# Altium project leddriver.PrjPCB
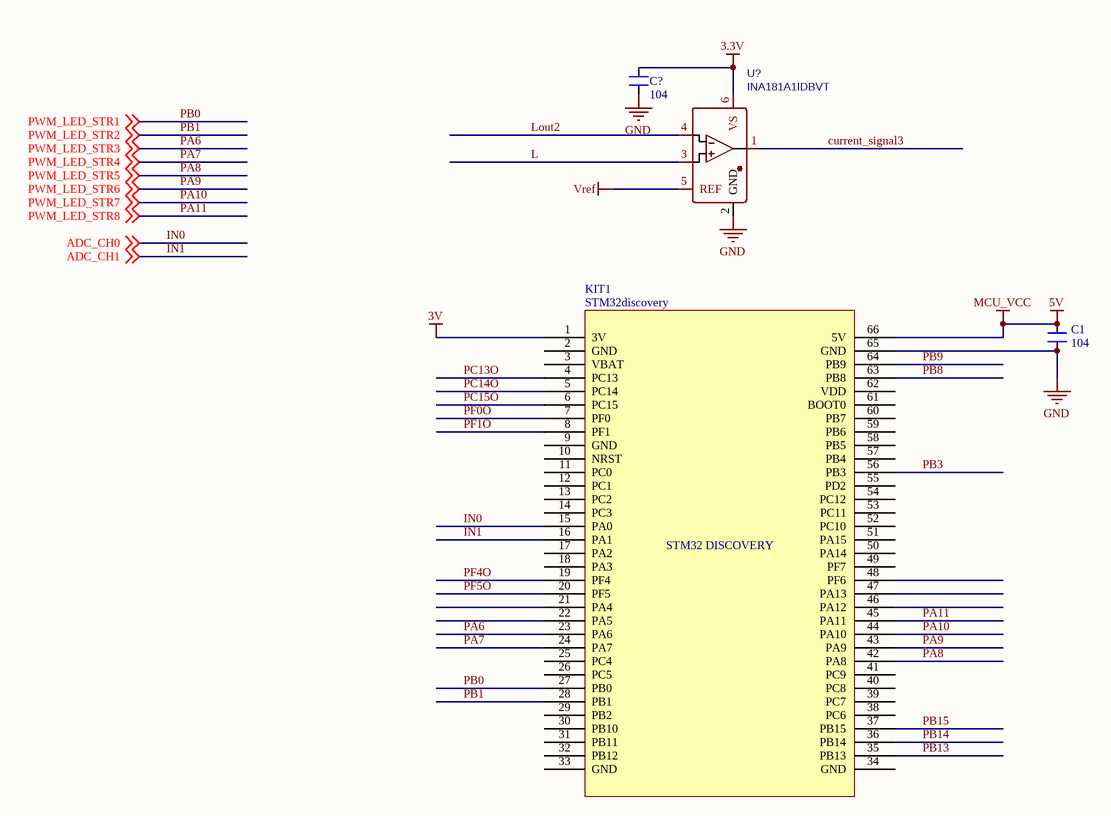
[diagram p0: leddriver.SchDoc]
3 sheets, 77 parts. Net scope: global (net labels, ports and power ports of the same name join across sheets).
Board file: leddriver.PcbDoc
Sheets:
  leddriver.SchDoc
  powerswitch.SchDoc
  PWRsupply.SchDoc

## Sheet leddriver.SchDoc: APTOMAT - Power Supply
size A4; Revision: 1.1.1; SheetNumber: 5; SheetTotal: 5; DrawnBy: KJP; ProjectNumber: 4397; PCBRevision: 0071KJP; DocumentSize: A4; PCAName: PCA10040; PCBNumber: 400150; ProjectName: Quark

### Parts
C1  104  [0805_HV]
C?  104  [0805_HV]
KIT1  STM32discovery  [STM32discovery_kit]
U?  INA181A1IDBVT  [SOT95P280X145-6N]

### Nets
3.3V: C?.2 U?.6(VS)
3V: KIT1.1(3V)
5V: C1.2 KIT1.66(5V)  [also labelled MCU_VCC]
GND: C1.1 C?.1 KIT1.65(GND) U?.2(GND)
Vref: U?.5(REF)
current_signal3: U?.1(OUT)
IN0: KIT1.15(PA0) ; off-sheet ADC_CH0  [also labelled ADC_CH0]
IN1: KIT1.16(PA1) ; off-sheet ADC_CH1  [also labelled ADC_CH1]
L: U?.3(IN+)
Lout2: U?.4(IN-)
PA6: KIT1.23(PA6) ; off-sheet PWM_LED_STR3  [also labelled PWM_LED_STR3]
PA7: KIT1.24(PA7) ; off-sheet PWM_LED_STR4  [also labelled PWM_LED_STR4]
PA8: KIT1.42(PA8) ; off-sheet PWM_LED_STR5  [also labelled PWM_LED_STR5]
PA9: KIT1.43(PA9) ; off-sheet PWM_LED_STR6  [also labelled PWM_LED_STR6]
PA10: KIT1.44(PA10) ; off-sheet PWM_LED_STR7  [also labelled PWM_LED_STR7]
PA11: KIT1.45(PA11) ; off-sheet PWM_LED_STR8  [also labelled PWM_LED_STR8]
PB0: KIT1.27(PB0) ; off-sheet PWM_LED_STR1  [also labelled PWM_LED_STR1]
PB1: KIT1.28(PB1) ; off-sheet PWM_LED_STR2  [also labelled PWM_LED_STR2]
PB3: KIT1.56(PB3)
PB8: KIT1.63(PB8)
PB9: KIT1.64(PB9)
PB13: KIT1.35(PB13)
PB14: KIT1.36(PB14)
PB15: KIT1.37(PB15)
PC13O: KIT1.4(PC13)
PC14O: KIT1.5(PC14)
PC15O: KIT1.6(PC15)
PF0O: KIT1.7(PF0)
PF1O: KIT1.8(PF1)
PF4O: KIT1.19(PF4)
PF5O: KIT1.20(PF5)

Not connected (* = marked no-connect by the designer): KIT1 2(GND) 3(VBAT) 9(GND) 10(NRST) 11(PC0) 12(PC1) 13(PC2) 14(PC3) 17(PA2) 18(PA3) 21(PA4) 22(PA5) 25(PC4) 26(PC5) 29(PB2) 30(PB10) 31(PB11) 32(PB12) 33(GND) 34(GND) 38(PC6) 39(PC7) 40(PC8) 41(PC9) 46(PA12) 47(PA13) 48(PF6) 49(PF7) 50(PA14) 51(PA15) 52(PC10) 53(PC11) 54(PC12) 55(PD2) 57(PB4) 58(PB5) 59(PB6) 60(PB7) 61(BOOT0) 62(VDD)

### Notes on the sheet
- (in symbol STM32Discovery_kit) STM32 DISCOVERY

### Library data of the parts
C1 C? = CM: Cap SMD; Value: 103
KIT1 = STM32Discovery_kit
U? = INA181: BOM_Manufacturer: Texas Instruments; BOM_Manufacturer Part: INA181A2IDBVT; Contributor: LCSC; BOM_Supplier: LCSC; BOM_Supplier Part: C116200; spicePre: U

## Sheet powerswitch.SchDoc
size B
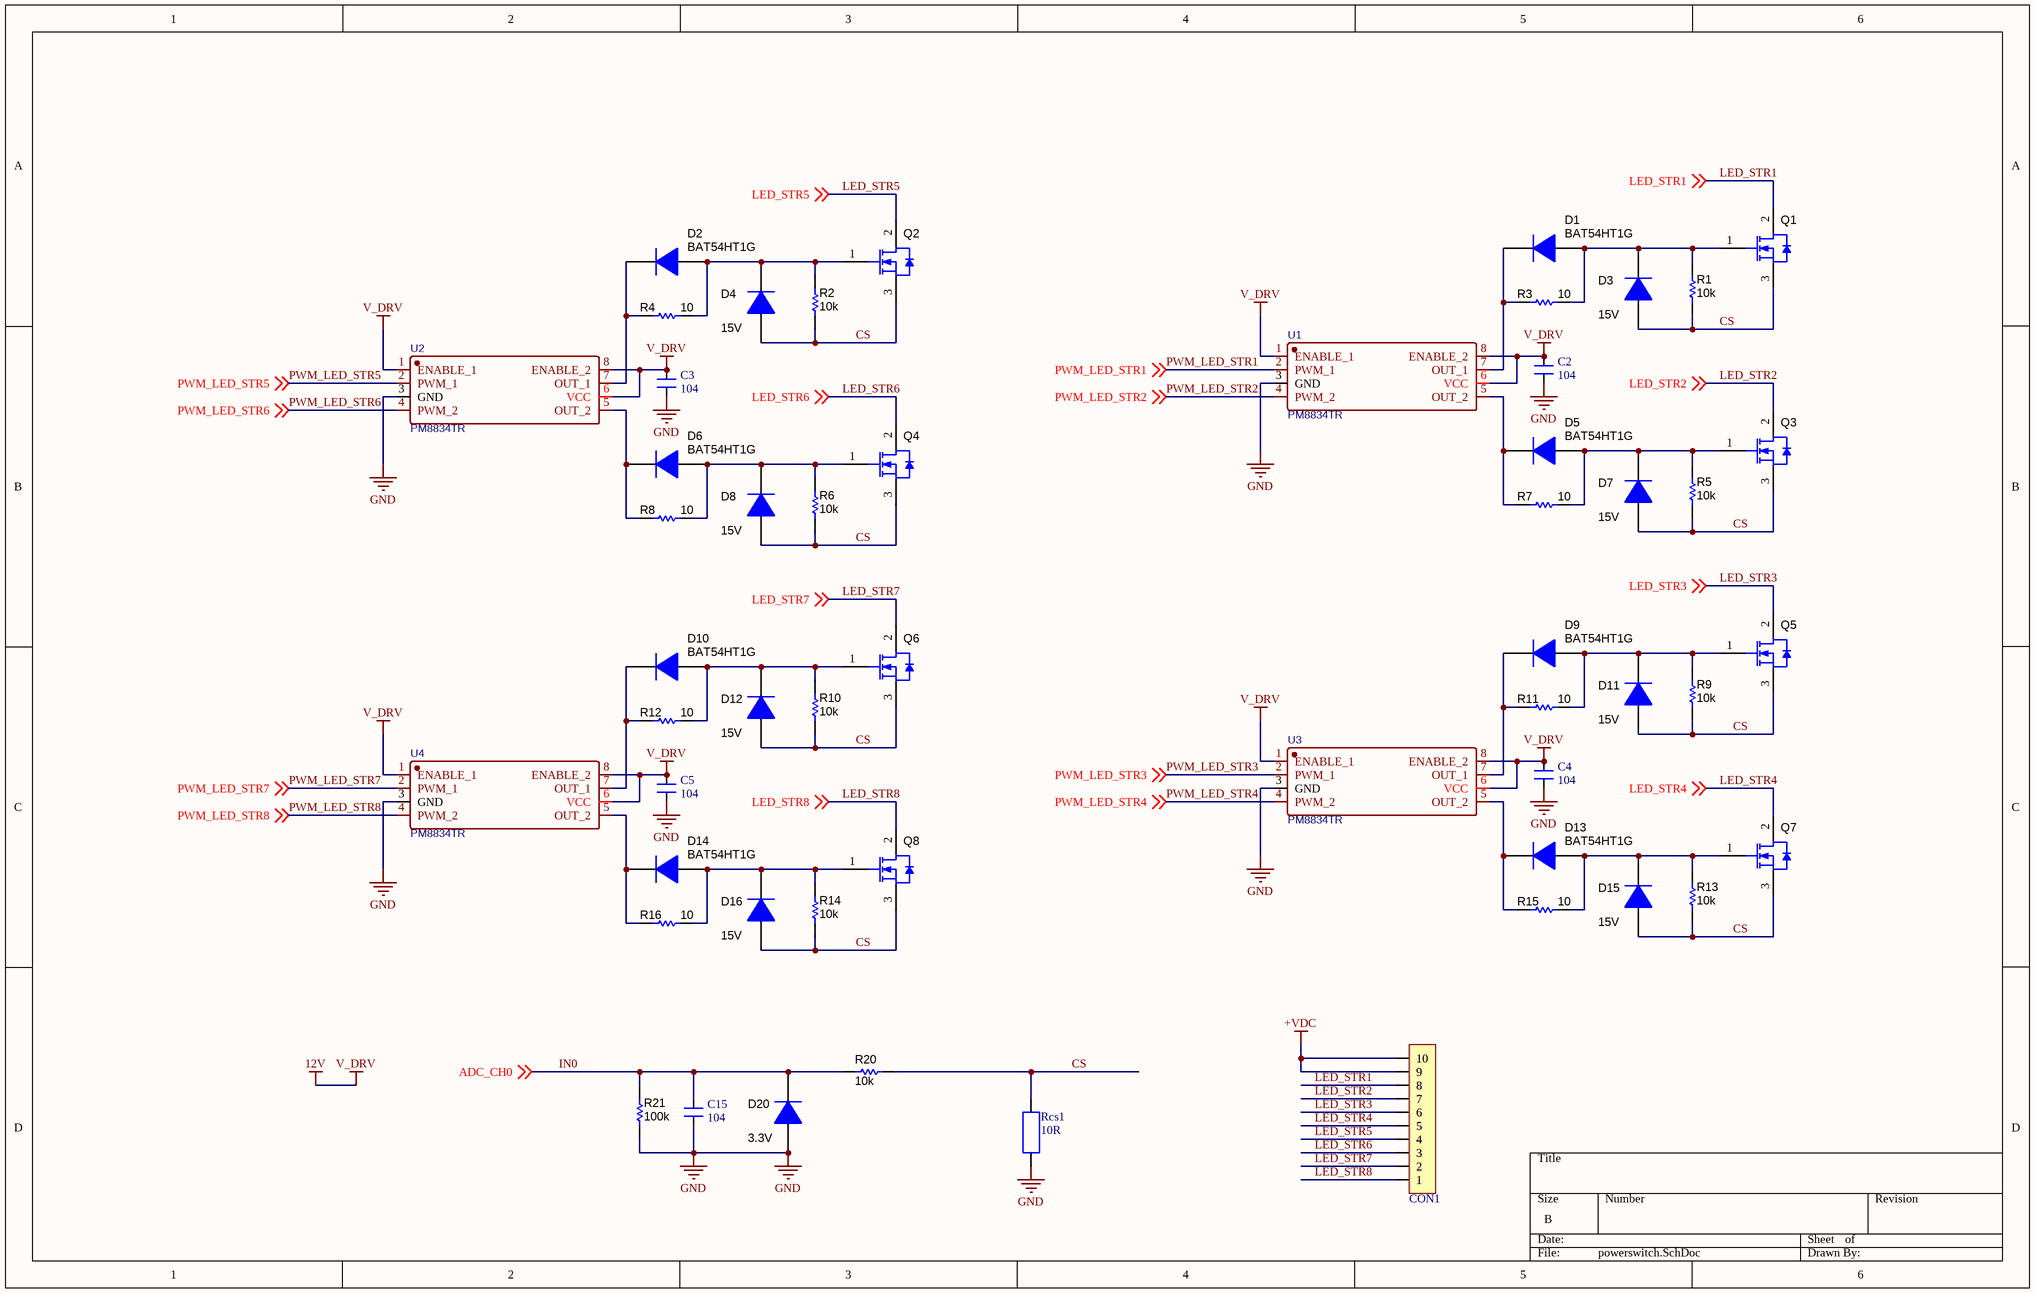
[diagram p1: powerswitch.SchDoc]

### Parts
C2  104  [0805_HV]
C3  104  [0805_HV]
C4  104  [0805_HV]
C5  104  [0805_HV]
C15  104  [0805_HV]
CON1  CON 10 EDG 5.08_MH  [Con 10 EDG 5.08]  (value not drawn)
D1  BAT54HT1G  [SOD-323]
D2  BAT54HT1G  [SOD-323]
D3  15V  [SOD-323]
D4  15V  [SOD-323]
D5  BAT54HT1G  [SOD-323]
D6  BAT54HT1G  [SOD-323]
D7  15V  [SOD-323]
D8  15V  [SOD-323]
D9  BAT54HT1G  [SOD-323]
D10  BAT54HT1G  [SOD-323]
D11  15V  [SOD-323]
D12  15V  [SOD-323]
D13  BAT54HT1G  [SOD-323]
D14  BAT54HT1G  [SOD-323]
D15  15V  [SOD-323]
D16  15V  [SOD-323]
D20  3.3V  [SOD-323]
Q1  IPA60R330P  [TO-220AB_NH]  (value not drawn)
Q2  IPA60R330P  [TO-220AB_NH]  (value not drawn)
Q3  IPA60R330P  [TO-220AB_NH]  (value not drawn)
Q4  IPA60R330P  [TO-220AB_NH]  (value not drawn)
Q5  IPA60R330P  [TO-220AB_NH]  (value not drawn)
Q6  IPA60R330P  [TO-220AB_NH]  (value not drawn)
Q7  IPA60R330P  [TO-220AB_NH]  (value not drawn)
Q8  IPA60R330P  [TO-220AB_NH]  (value not drawn)
R1  10k  [Tro SMD 0805]
R2  10k  [Tro SMD 0805]
R3  10  [Tro SMD 0805]
R4  10  [Tro SMD 0805]
R5  10k  [Tro SMD 0805]
R6  10k  [Tro SMD 0805]
R7  10  [Tro SMD 0805]
R8  10  [Tro SMD 0805]
R9  10k  [Tro SMD 0805]
R10  10k  [Tro SMD 0805]
R11  10  [Tro SMD 0805]
R12  10  [Tro SMD 0805]
R13  10k  [Tro SMD 0805]
R14  10k  [Tro SMD 0805]
R15  10  [Tro SMD 0805]
R16  10  [Tro SMD 0805]
R20  10k  [Tro SMD 0805]
R21  100k  [Tro SMD 0805]
Rcs1  10R  [TRO_VACH_2W]
U1  PM8834TR  [SOP 8]
U2  PM8834TR  [SOP 8]
U3  PM8834TR  [SOP 8]
U4  PM8834TR  [SOP 8]

### Nets
12V: C2.2 C3.2 C4.2 C5.2 U1.1(ENABLE_1) U1.6(VCC) U1.8(ENABLE_2) U2.1(ENABLE_1) U2.6(VCC) U2.8(ENABLE_2) U3.1(ENABLE_1) U3.6(VCC) U3.8(ENABLE_2) U4.1(ENABLE_1) U4.6(VCC) U4.8(ENABLE_2)  [also labelled V_DRV]
+VDC: CON1.9 CON1.10
GND: C2.1 C3.1 C4.1 C5.1 C15.1 D20.2(A) R21.2 Rcs1.1 U1.3(GND) U2.3(GND) U3.3(GND) U4.3(GND)
CS: D3.2(A) D4.2(A) D7.2(A) D8.2(A) D11.2(A) D12.2(A) D15.2(A) D16.2(A) Q1.3(S) Q2.3(S) Q3.3(S) Q4.3(S) Q5.3(S) Q6.3(S) Q7.3(S) Q8.3(S) R1.2 R2.2 R5.2 R6.2 R9.2 R10.2 R13.2 R14.2 R20.2 Rcs1.2
IN0: C15.2 D20.1(K) R20.1 R21.1 ; off-sheet ADC_CH0  [also labelled ADC_CH0]
LED_STR1: CON1.8 Q1.2(D) ; off-sheet LED_STR1
LED_STR2: CON1.7 Q3.2(D) ; off-sheet LED_STR2
LED_STR3: CON1.6 Q5.2(D) ; off-sheet LED_STR3
LED_STR4: CON1.5 Q7.2(D) ; off-sheet LED_STR4
LED_STR5: CON1.4 Q2.2(D) ; off-sheet LED_STR5
LED_STR6: CON1.3 Q4.2(D) ; off-sheet LED_STR6
LED_STR7: CON1.2 Q6.2(D) ; off-sheet LED_STR7
LED_STR8: CON1.1 Q8.2(D) ; off-sheet LED_STR8
PWM_LED_STR1: U1.2(PWM_1) ; off-sheet PWM_LED_STR1  [project net PB0]
PWM_LED_STR2: U1.4(PWM_2) ; off-sheet PWM_LED_STR2  [project net PB1]
PWM_LED_STR3: U3.2(PWM_1) ; off-sheet PWM_LED_STR3  [project net PA6]
PWM_LED_STR4: U3.4(PWM_2) ; off-sheet PWM_LED_STR4  [project net PA7]
PWM_LED_STR5: U2.2(PWM_1) ; off-sheet PWM_LED_STR5  [project net PA8]
PWM_LED_STR6: U2.4(PWM_2) ; off-sheet PWM_LED_STR6  [project net PA9]
PWM_LED_STR7: U4.2(PWM_1) ; off-sheet PWM_LED_STR7  [project net PA10]
PWM_LED_STR8: U4.4(PWM_2) ; off-sheet PWM_LED_STR8  [project net PA11]
NetD1_1: D1.1(K) R3.2 U1.7(OUT_1)
NetD1_2: D1.2(A) D3.1(K) Q1.1(G) R1.1 R3.1
NetD2_1: D2.1(K) R4.2 U2.7(OUT_1)
NetD2_2: D2.2(A) D4.1(K) Q2.1(G) R2.1 R4.1
NetD5_1: D5.1(K) R7.2 U1.5(OUT_2)
NetD5_2: D5.2(A) D7.1(K) Q3.1(G) R5.1 R7.1
NetD6_1: D6.1(K) R8.2 U2.5(OUT_2)
NetD6_2: D6.2(A) D8.1(K) Q4.1(G) R6.1 R8.1
NetD9_1: D9.1(K) R11.2 U3.7(OUT_1)
NetD9_2: D9.2(A) D11.1(K) Q5.1(G) R9.1 R11.1
NetD10_1: D10.1(K) R12.2 U4.7(OUT_1)
NetD10_2: D10.2(A) D12.1(K) Q6.1(G) R10.1 R12.1
NetD13_1: D13.1(K) R15.2 U3.5(OUT_2)
NetD13_2: D13.2(A) D15.1(K) Q7.1(G) R13.1 R15.1
NetD14_1: D14.1(K) R16.2 U4.5(OUT_2)
NetD14_2: D14.2(A) D16.1(K) Q8.1(G) R14.1 R16.1

### Library data of the parts
C2-C5 C15 = CM: Cap SMD; Value: 103
CON1 = CON 10 EDG 5.08_MH: CON 10 EDG 5.08 (xanh cong)
D1 D2 D5 D6 D9 D10 D13 D14 = MMDL914-TP: Diode, Switching, 100 V, 0.2 A, SOD-323; Manufacturer: Micro Commercial Components; U/M: EA; Vf_V: 1; Value: 100V; Value1: 0.2A; Value2: 1V; Io_A: 0.2; Vr_V: 100; TJmax_C: 150; SizeAreaWB_mm2: 8.695; SizeArea_mm2: 3.645; SizeX_mm: 2.7; SizeY_mm: 1.35; AEC Category: Q101; SymbolVersion: 2008-12-08; PartNumber: BAT54HT1G; PackageReference: SOD-323; CompType: Diode; MountType: SMT; Type: Switching; RoHS: Y; SizeZ_mm: 1; Published: 2008-06-26; Publisher: Texas Instruments; LatestRevisionDate: 2016-10-18; ComponentLink1Description: Datasheet link; ComponentLink1URL: http://www.mccsemi.com/up_pdf/MMDL914(SOD-323).pdf; Supplier 1: Digi-Key; Supplier Part Number 1: MMDL914-TPMSCT-ND; AEC Qualified: ?
D3 D4 D7 D8 D11 D12 D15 D16 D20 = MMDL914-TP: Diode, Switching, 100 V, 0.2 A, SOD-323; PartNumber: BAV21W-7-F; Manufacturer: Micro Commercial Components; U/M: EA; Vf_V: 1; Value: 100V; Value1: 0.2A; Value2: 1V; Io_A: 0.2; Vr_V: 100; TJmax_C: 150; SizeAreaWB_mm2: 8.695; SizeArea_mm2: 3.645; SizeX_mm: 2.7; SizeY_mm: 1.35; AEC Category: Q101; SymbolVersion: 2008-12-08; PackageReference: SOD-323; CompType: Diode; MountType: SMT; Type: Switching; RoHS: Y; SizeZ_mm: 1; Published: 2008-06-26; Publisher: Texas Instruments; LatestRevisionDate: 2016-10-18; ComponentLink1Description: Datasheet link; ComponentLink1URL: http://www.mccsemi.com/up_pdf/MMDL914(SOD-323).pdf; Supplier 1: Digi-Key; Supplier Part Number 1: MMDL914-TPMSCT-ND; AEC Qualified: ?
Q1-Q8 = IPP60R190P6: MOSFET N-CH 600V 10.6A TO220; PartNumber: IPA60R330P6XKSA1; Manufacturer: Infineon Technologies; SymbolCreator: x0199378; SymbolVersion: 2015-04-01; CompType: MOSFET; Value: 600 V; RoHS: Y; MountType: TH; ComponentLink1Description: Datasheet link; ComponentLink1URL: http://www.infineon.com/dgdl/Infineon-IPX60R330P6-DS-v02_02-EN.pdf?fileId=db3a3043416e106e01416e6a5f240149; Supplier Part Number 1: IPA60R330P6XKSA1-ND; Supplier 1: Digikey; Part Used: IPA60R330P
R1-R16 R20 R21 = R nho: RES, 100, 1%, 0.1 W, 0402; PartNumber: ERJ-2RKF1000X; Manufacturer: Panasonic; CompType: Resistor; Res_ohm: 100; Value_Code: 100R; Tolerance_%: 1; Power_W: 0.1; Value2: 0.1W; VDC_V: 50; TempCo: 100 ppm/C; EIA_Code: E96; U/M: EA; AEC Category: Q200; SymbolVersion: 2009-05-29; PackageReference: 0402; RoHS: Y; Value1: 1%; MountType: SMT; Technology: Thick Film; Published: 2008-06-26; Publisher: Texas Instruments; LatestRevisionDate: 2016-01-08; ComponentLink1Description: Datasheet link; ComponentLink1URL: http://industrial.panasonic.com/www-data/pdf/AOA0000/AOA0000CE2.pdf; Supplier 1: Digi-Key; Supplier Part Number 1: P100LCT-ND; Supplier 2: Mouser; Supplier Part Number 2: 667-ERJ-2RKF1000X; Supplier 3: Farnell; Supplier Part Number 3: 2304034; AEC Qualified: ?
  R1 R2 R5 R6 R9 R10 R13 R14 R20: Value: 10k
  R3 R4 R7 R8 R11 R12 R15 R16: Value: 10
  R21: Value: 100k
Rcs1 = TRO_CS_2W_MH: Value: V?
U1-U4 = PM8834TR: BOM_Manufacturer: STMicroelectronics; Contributor: LCSC; BOM_Supplier: LCSC; BOM_Supplier Part: C221495; BOM_Manufacturer Part: PM8834TR; spicePre: U

## Sheet PWRsupply.SchDoc
size A
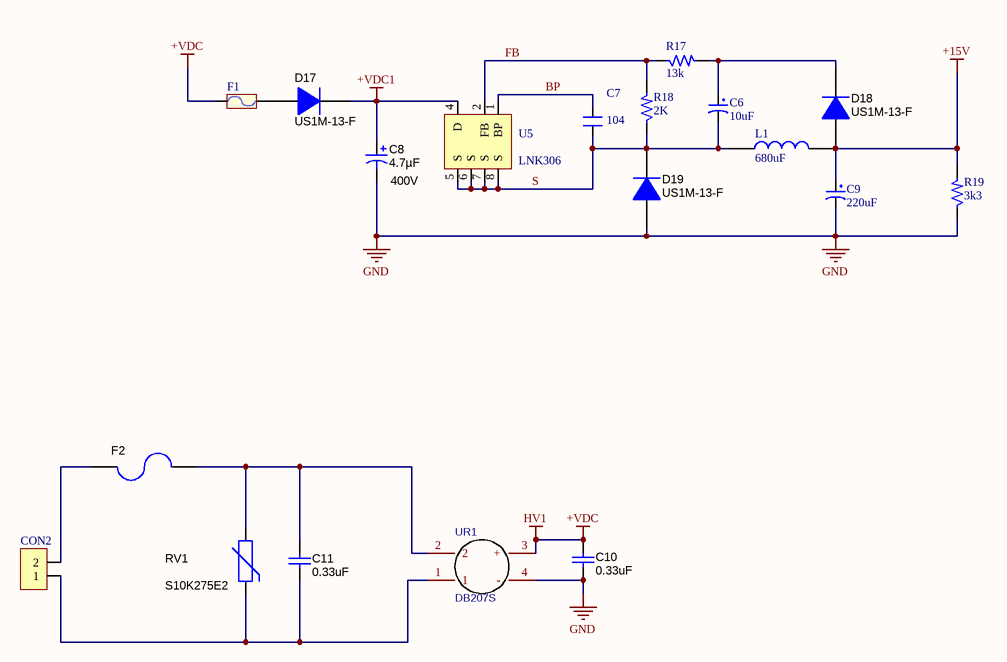
[diagram p2: PWRsupply.SchDoc]

### Parts
C6  10uF  [TU_NHOM_10uF_MH]
C7  104  [0805_Cap]
C8  ValueDisplayed: 4.7µF  Value2: 400V  [CAP-PANACAP-G-GENERIC]  (hidden comment: 400AX6R8M8x11)
C9  220uF  [TU_NHOM_2.5_MH]
C10  value 0.33uF  [B32922_12mm]  (hidden comment: B32922C3334M189)
C11  value 0.33uF  [B32922_12mm]  (hidden comment: B32922C3334M189)
CON2  CON 2 EDG 5.08_MH  [CON 2 EDG 5.08]  (value not drawn)
D17  US1M-13-F  [SMB]
D18  US1M-13-F  [SMB]
D19  US1M-13-F  [SMB]
F1  FUSE_AUTO_0.5A 8V 1206_MH  [FUSE 1206]  (value not drawn)
F2  37015000430  [Fuse 5x20]  (value not drawn)
L1  680uF  [Inductor 4.5x5]
R17  13k  [0805_R]
R18  2K  [0805_R]
R19  3k3  [0805_R]
RV1  S10K275E2  [VAR_S10K275E2]
U5  LNK306  [SOP 7]
UR1  DB207S  [DB207S]

### Nets
+15V: C9.1 D18.2(A) L1.2 R19.2
+VDC: C10.2 F1.1 UR1.3(+)  [also labelled HV1]
+VDC1: C8.1(+) D17.1(K) U5.4(D)
GND: C8.2(-) C9.2 C10.1 D19.2(A) R19.1 UR1.4(-)
BP: C7.2 U5.1(BP)
FB: R17.1 R18.2 U5.2(FB)
S: C6.2 C7.1 D19.1(K) L1.1 R18.1 U5.5(S) U5.6(S) U5.7(S) U5.8(S)
NetC6_1: C6.1 D18.1(K) R17.2
NetC11_1: C11.1 CON2.1 RV1.2 UR1.1
NetC11_2: C11.2 F2.1 RV1.1 UR1.2
NetCON2_2: CON2.2 F2.2
NetD17_2: D17.2(A) F1.2

### Library data of the parts
C6 = TU_NHOM_10uF_25V_MH: Value: 47uF/16 - 50V; Description 1: 470uF/6,3V - 330uF/10V - 220uF/16V; Description 2: 100uF/25V - 35V - 47uF/50V - 22uF/100V; Description 3: 33uF => 47uF/63V - 1uF => 4,7uF/160V; Description 4: 1uF => 2,2uF/250V - 1uF/350V
C7 = CM: Cap SMD; Value: 103
C8 = 400AX6R8M8x11: CAP, AL, 6.8uF, 400V, +/-20%, TH; Manufacturer: Rubycon; Polarized: Y; CompType: Capacitor; U/M: EA; Cap_F: 0.0000068; Tolerance_%: 20; Value1: Unknown; VDC_V: 400; TaMin_C: -40; TaMax_C: 105; Cap_Case: 8x11; SymbolVersion: 2008-07-09; Value: 6.8uF; PartNumber: 400AX6R8M8x11; PackageReference: 8x11; RoHS: Y; MountType: TH; Technology: AL; Series: AX; Publisher: Texas Instruments; LatestRevisionDate: 2013-08-02; ComponentLink1Description: Datasheet link; ComponentLink1URL: http://www.rubycon.co.jp/de/catalog/e_pdfs/aluminum/e_ax.pdf
C9 = TU_NHOM_220uF_25V_MH: LINK: https://item.taobao.com/item.htm?spm=a230r.1.14.282.6c612953FsebRk&id=546158429968&ns=1&abbucket=10#detail
C10 C11 = BFC233620154: CAP FILM 0.33UF 630VDC RADIAL; Manufacturer: EPCOS(TDK); CompType: Film Capacitor; SymbolCreator: x0199378; PartNumber: B32922C3334M189; RoHS: Y; MountType: TH; ComponentLink1Description: Datasheet link; ComponentLink1URL: http://en.tdk.eu/inf/20/20/db/fc_2009/X2_B32921_928.pdf; SymbolVersion: 2015-01-29
CON2 = CON 2 EDG 5.08_MH: CON 2 EDG 5.08 (xanh cong)
D17-D19 = MURS160-13-F: Diode, Ultrafast, 600V, 1A, SMB; Manufacturer: Diodes Inc.; U/M: EA; Vf_V: 1.25; Value2: 1.25V; Io_A: 1; Vr_V: 600; TJmax_C: 150; RJC_CperW: 13; PartNumber: US1M-13-F; CompType: Diode; SymbolVersion: 2008-12-08; MountType: SMT; RoHS: Y; Value: 600V; PackageReference: SMB; Value1: 1A; Type: Ultrafast; Published: 2008-06-26; Publisher: Texas Instruments; LatestRevisionDate: 2013-06-21; ComponentLink1Description: Datasheet link; ComponentLink1URL: http://www.diodes.com/datasheets/ds30130.pdf; Supplier 1: Digi-Key; Supplier 2: Mouser; Supplier 3: Farnell
F1 = FUSE_AUTO_0.5A 8V 1206_MH: Fuse
F2 = 0216008.MXESPP: FUSE BOARD MOUNT 5A 250VAC RAD; Manufacturer: Littelfuse Inc; U/M: EA; VDC_V: 250; Irating_A: 5; Rtyp_Ohm: 0.0123; Soldering_Wave_MaxTemp_C: 260; SymbolVersion: 2008-07-09; PartNumber: 37015000430; PackageReference: Radial, Can, Vertical; CompType: Fuse; Published: 2009-03-05; RoHS: Y; VAC_V: 250; Publisher: Texas Instruments; LatestRevisionDate: 2014-04-17; ComponentLink1Description: Datasheet link; ComponentLink1URL: http://www.littelfuse.com/~/media/electronics/datasheets/fuses/littelfuse_fuse_370_datasheet.pdf.pdf; Soldering_Wave_MaxTime_s: 5; MountType: TH; Supplier 1: Digi-Key; Supplier Part Number 1: F4482-ND
L1 = Inductor 4.5x5_MH
R17-R19 = R: Resistor 1/4W; Value: R1/4W - 1K
RV1 = S10K275E2: Varistor 275V RMS 10MM Radial, TH; Manufacturer: EPCOS Inc; SymbolCreator: a0412235; SymbolVersion: 2012-06-04; PartNumber: S10K275E2; MountType: TH; ComponentLink1Description: Datasheet URL; ComponentLink1URL: http://www.epcos.com/inf/70/db/var_08/SIOV_Leaded_AdvanceD.pdf; RoHS: Y; PackageReference: 10mm Radial; Publisher: Texas Instruments; LatestRevisionDate: 2013-02-24; Supplier 1: Digi-Key; Supplier Part Number 1: 495-1433-ND
U5 = Component_1
UR1 = DB207S: BOM_Manufacturer: DYELEC; SMT Type: Extend; BOM_Supplier: LCSC; BOM_Manufacturer Part: DB207S; image: //image.lceda.cn/szlcsc/C84160.jpg; BOM_Supplier Part: C84160; BOM_LCSC Assembly: Yes; spicePre: U

## Nets that join several sheets
+VDC: powerswitch (CON1.9 CON1.10), PWRsupply (C10.2 F1.1 UR1.3)
GND: leddriver (C1.1 C?.1 KIT1.65 U?.2), powerswitch (12 pins), PWRsupply (6 pins)
IN0: leddriver (KIT1.15), powerswitch (C15.2 D20.1 R20.1 R21.1)
PA6: leddriver (KIT1.23), powerswitch (U3.2)
PA7: leddriver (KIT1.24), powerswitch (U3.4)
PA8: leddriver (KIT1.42), powerswitch (U2.2)
PA9: leddriver (KIT1.43), powerswitch (U2.4)
PA10: leddriver (KIT1.44), powerswitch (U4.2)
PA11: leddriver (KIT1.45), powerswitch (U4.4)
PB0: leddriver (KIT1.27), powerswitch (U1.2)
PB1: leddriver (KIT1.28), powerswitch (U1.4)